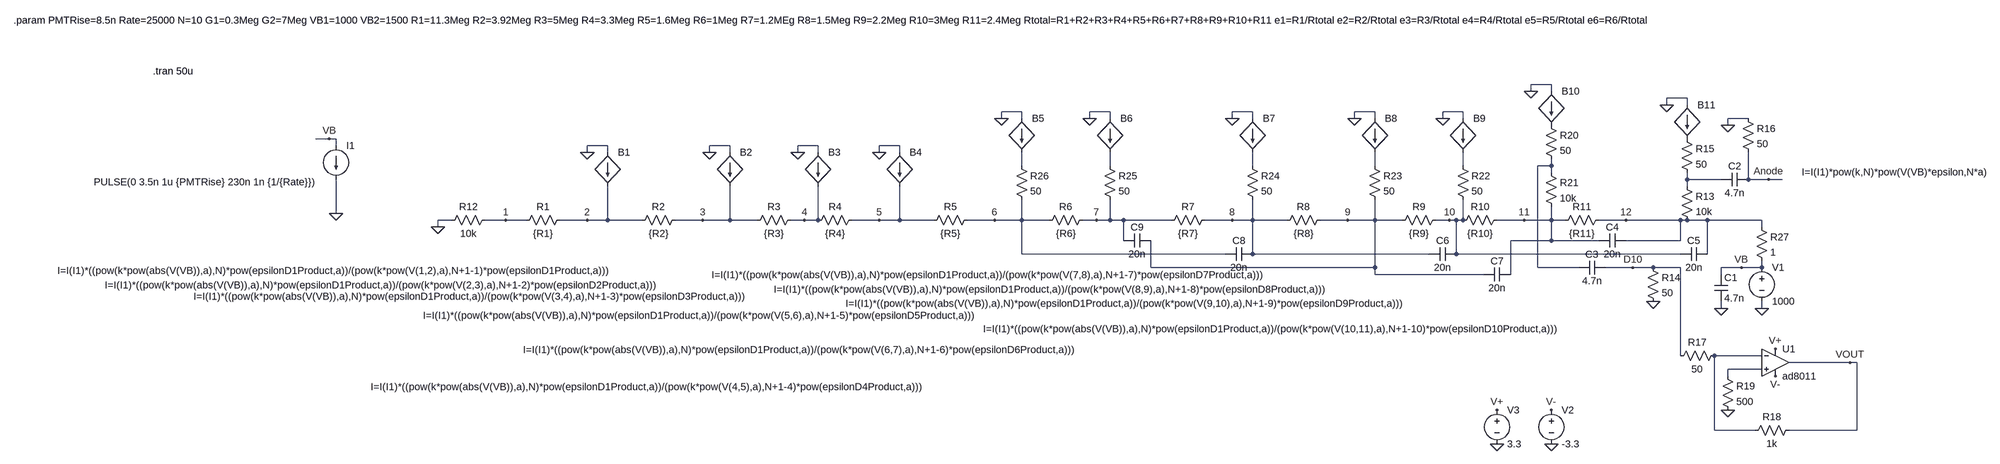
[diagram p0: schematic PMT Model_draft1.asc]
PMT Model_draft1.asc, the LTspice schematic file:
Version 4
SHEET 1 10492 724
WIRE 2576 -144 2528 -144
WIRE 2528 -128 2528 -144
WIRE 2576 -128 2576 -144
WIRE 2896 -112 2848 -112
WIRE 2848 -96 2848 -112
WIRE 2896 -96 2896 -112
WIRE 1328 -80 1280 -80
WIRE 1536 -80 1488 -80
WIRE 1872 -80 1824 -80
WIRE 2160 -80 2112 -80
WIRE 2368 -80 2320 -80
WIRE 1280 -64 1280 -80
WIRE 1328 -64 1328 -80
WIRE 1488 -64 1488 -80
WIRE 1536 -64 1536 -80
WIRE 1824 -64 1824 -80
WIRE 1872 -64 1872 -80
WIRE 2112 -64 2112 -80
WIRE 2160 -64 2160 -80
WIRE 2320 -64 2320 -80
WIRE 2368 -64 2368 -80
WIRE 3040 -64 2992 -64
WIRE 2992 -48 2992 -64
WIRE -304 -16 -336 -16
WIRE -288 -16 -304 -16
WIRE -288 0 -288 -16
WIRE 352 0 304 0
WIRE 640 0 592 0
WIRE 848 0 800 0
WIRE 1040 0 992 0
WIRE 304 16 304 0
WIRE 352 16 352 0
WIRE 592 16 592 0
WIRE 640 16 640 0
WIRE 800 16 800 0
WIRE 848 16 848 0
WIRE 992 16 992 0
WIRE 1040 16 1040 0
WIRE 1328 48 1328 16
WIRE 1536 48 1536 16
WIRE 1872 48 1872 16
WIRE 2160 48 2160 16
WIRE 2368 48 2368 16
WIRE 2576 48 2576 32
WIRE 2576 48 2544 48
WIRE 2576 64 2576 48
WIRE 2896 80 2896 64
WIRE 2976 80 2896 80
WIRE 3040 80 3040 16
WIRE 3088 80 3040 80
WIRE 3120 80 3088 80
WIRE 2896 96 2896 80
WIRE -288 160 -288 80
WIRE -16 176 -48 176
WIRE 112 176 64 176
WIRE 160 176 112 176
WIRE 304 176 240 176
WIRE 352 176 352 96
WIRE 352 176 304 176
WIRE 432 176 352 176
WIRE 576 176 512 176
WIRE 640 176 640 96
WIRE 640 176 576 176
WIRE 704 176 640 176
WIRE 816 176 784 176
WIRE 848 176 848 96
WIRE 848 176 816 176
WIRE 992 176 928 176
WIRE 1040 176 1040 96
WIRE 1040 176 992 176
WIRE 1120 176 1040 176
WIRE 1264 176 1200 176
WIRE 1328 176 1328 128
WIRE 1328 176 1264 176
WIRE 1392 176 1328 176
WIRE 1504 176 1472 176
WIRE 1536 176 1536 128
WIRE 1536 176 1504 176
WIRE 1568 176 1536 176
WIRE 1680 176 1568 176
WIRE 1824 176 1760 176
WIRE 1872 176 1872 128
WIRE 1872 176 1824 176
WIRE 1952 176 1872 176
WIRE 2096 176 2032 176
WIRE 2160 176 2160 128
WIRE 2160 176 2096 176
WIRE 2224 176 2160 176
WIRE 2336 176 2304 176
WIRE 2352 176 2336 176
WIRE 2368 176 2368 128
WIRE 2368 176 2352 176
WIRE 2512 176 2448 176
WIRE 2576 176 2576 144
WIRE 2576 176 2512 176
WIRE 2608 176 2576 176
WIRE 2752 176 2688 176
WIRE 2880 176 2752 176
WIRE 2896 176 2880 176
WIRE 2944 176 2896 176
WIRE 3072 176 2944 176
WIRE -48 192 -48 176
WIRE 3072 192 3072 176
WIRE 1568 224 1568 176
WIRE 2576 224 2576 176
WIRE 2576 224 2480 224
WIRE 2688 224 2576 224
WIRE 2880 224 2880 176
WIRE 2880 224 2752 224
WIRE 1328 256 1328 176
WIRE 1808 256 1328 256
WIRE 1872 256 1872 176
WIRE 2288 256 1872 256
WIRE 2352 256 2352 176
WIRE 2880 256 2352 256
WIRE 2944 256 2944 176
WIRE 1632 288 1632 224
WIRE 2160 288 2160 176
WIRE 2160 288 1632 288
WIRE 2544 288 2544 48
WIRE 2640 288 2544 288
WIRE 2768 288 2704 288
WIRE 2816 288 2768 288
WIRE 2880 288 2816 288
WIRE 3024 288 2976 288
WIRE 3072 288 3072 272
WIRE 3072 288 3024 288
WIRE 2160 304 2160 288
WIRE 2416 304 2160 304
WIRE 2480 304 2480 224
WIRE 2976 304 2976 288
WIRE 2976 384 2976 368
WIRE 3072 384 3072 368
WIRE 2880 496 2880 288
WIRE 3072 496 2960 496
WIRE 3280 512 3136 512
WIRE 3296 512 3280 512
WIRE 3072 528 2992 528
WIRE 2992 544 2992 528
WIRE 2960 672 2960 496
WIRE 3056 672 2960 672
WIRE 3296 672 3296 512
WIRE 3296 672 3136 672
FLAG 3072 384 0
FLAG 2976 384 0
FLAG 304 16 0
FLAG 3024 288 VB
FLAG 112 176 1
FLAG 304 176 2
FLAG 592 16 0
FLAG 576 176 3
FLAG 800 16 0
FLAG 816 176 4
FLAG 992 16 0
FLAG 992 176 5
FLAG 1280 -64 0
FLAG 1264 176 6
FLAG 1488 -64 0
FLAG 1504 176 7
FLAG 1824 -64 0
FLAG 1824 176 8
FLAG 2112 -64 0
FLAG 2096 176 9
FLAG 2320 -64 0
FLAG 2336 176 10
FLAG 2512 176 11
FLAG 2528 -128 0
FLAG 2752 176 12
FLAG 2816 368 0
FLAG 2768 288 D10
FLAG -304 -16 VB
FLAG -288 160 0
FLAG -48 192 0
FLAG 2848 -96 0
FLAG 2992 -48 0
FLAG 3088 80 Anode
FLAG 2448 704 0
FLAG 2576 704 0
FLAG 2576 624 V-
FLAG 3104 544 V-
FLAG 2448 624 V+
FLAG 3104 480 V+
FLAG 2992 624 0
FLAG 3280 512 VOUT
SYMBOL res 256 160 R90
WINDOW 0 0 56 VBottom 2
WINDOW 3 32 56 VTop 2
SYMATTR InstName R1
SYMATTR Value {R1}
SYMBOL current -288 0 R0
WINDOW 3 -571 86 Left 2
WINDOW 123 0 0 Left 0
WINDOW 39 0 0 Left 0
SYMATTR Value PULSE(0 3.5n 1u {PMTRise} 230n 1n {1/{Rate}})
SYMATTR InstName I1
SYMBOL voltage 3072 272 R0
WINDOW 123 0 0 Left 0
WINDOW 39 0 0 Left 0
SYMATTR InstName V1
SYMATTR Value 1000
SYMBOL cap 2960 304 R0
SYMATTR InstName C1
SYMATTR Value 4.7n
SYMBOL bi 352 16 R0
WINDOW 3 -1297 279 Left 2
SYMATTR Value I=I(I1)*((pow(k*pow(abs(V(VB)),a),N)*pow(epsilonD1Product,a))/(pow(k*pow(V(1,2),a),N+1-1)*pow(epsilonD1Product,a)))
SYMATTR InstName B1
SYMBOL bi 640 16 R0
WINDOW 3 -1473 313 Left 2
SYMATTR Value I=I(I1)*((pow(k*pow(abs(V(VB)),a),N)*pow(epsilonD1Product,a))/(pow(k*pow(V(2,3),a),N+1-2)*pow(epsilonD2Product,a)))
SYMATTR InstName B2
SYMBOL res 528 160 R90
WINDOW 0 0 56 VBottom 2
WINDOW 3 32 56 VTop 2
SYMATTR InstName R2
SYMATTR Value {R2}
SYMBOL bi 848 16 R0
WINDOW 3 -1472 340 Left 2
SYMATTR Value I=I(I1)*((pow(k*pow(abs(V(VB)),a),N)*pow(epsilonD1Product,a))/(pow(k*pow(V(3,4),a),N+1-3)*pow(epsilonD3Product,a)))
SYMATTR InstName B3
SYMBOL res 800 160 R90
WINDOW 0 0 56 VBottom 2
WINDOW 3 32 56 VTop 2
SYMATTR InstName R3
SYMATTR Value {R3}
SYMBOL res 944 160 R90
WINDOW 0 0 56 VBottom 2
WINDOW 3 32 56 VTop 2
SYMATTR InstName R4
SYMATTR Value {R4}
SYMBOL bi 1040 16 R0
WINDOW 3 -1246 553 Left 2
SYMATTR Value I=I(I1)*((pow(k*pow(abs(V(VB)),a),N)*pow(epsilonD1Product,a))/(pow(k*pow(V(4,5),a),N+1-4)*pow(epsilonD4Product,a)))
SYMATTR InstName B4
SYMBOL bi 1328 -64 R0
WINDOW 3 -1411 465 Left 2
SYMATTR Value I=I(I1)*((pow(k*pow(abs(V(VB)),a),N)*pow(epsilonD1Product,a))/(pow(k*pow(V(5,6),a),N+1-5)*pow(epsilonD5Product,a)))
SYMATTR InstName B5
SYMBOL res 1216 160 R90
WINDOW 0 0 56 VBottom 2
WINDOW 3 32 56 VTop 2
SYMATTR InstName R5
SYMATTR Value {R5}
SYMBOL bi 1536 -64 R0
WINDOW 3 -1383 546 Left 2
SYMATTR Value I=I(I1)*((pow(k*pow(abs(V(VB)),a),N)*pow(epsilonD1Product,a))/(pow(k*pow(V(6,7),a),N+1-6)*pow(epsilonD6Product,a)))
SYMATTR InstName B6
SYMBOL res 1488 160 R90
WINDOW 0 0 56 VBottom 2
WINDOW 3 32 56 VTop 2
SYMATTR InstName R6
SYMATTR Value {R6}
SYMBOL res 1776 160 R90
WINDOW 0 0 56 VBottom 2
WINDOW 3 32 56 VTop 2
SYMATTR InstName R7
SYMATTR Value {R7}
SYMBOL bi 1872 -64 R0
WINDOW 3 -1275 369 Left 2
SYMATTR Value I=I(I1)*((pow(k*pow(abs(V(VB)),a),N)*pow(epsilonD1Product,a))/(pow(k*pow(V(7,8),a),N+1-7)*pow(epsilonD7Product,a)))
SYMATTR InstName B7
SYMBOL bi 2160 -64 R0
WINDOW 3 -1416 403 Left 2
SYMATTR Value I=I(I1)*((pow(k*pow(abs(V(VB)),a),N)*pow(epsilonD1Product,a))/(pow(k*pow(V(8,9),a),N+1-8)*pow(epsilonD8Product,a)))
SYMATTR InstName B8
SYMBOL res 2048 160 R90
WINDOW 0 0 56 VBottom 2
WINDOW 3 32 56 VTop 2
SYMATTR InstName R8
SYMATTR Value {R8}
SYMBOL bi 2368 -64 R0
WINDOW 3 -1455 437 Left 2
SYMATTR Value I=I(I1)*((pow(k*pow(abs(V(VB)),a),N)*pow(epsilonD1Product,a))/(pow(k*pow(V(9,10),a),N+1-9)*pow(epsilonD9Product,a)))
SYMATTR InstName B9
SYMBOL res 2320 160 R90
WINDOW 0 0 56 VBottom 2
WINDOW 3 32 56 VTop 2
SYMATTR InstName R9
SYMATTR Value {R9}
SYMBOL res 2464 160 R90
WINDOW 0 0 56 VBottom 2
WINDOW 3 32 56 VTop 2
SYMATTR InstName R10
SYMATTR Value {R10}
SYMBOL bi 2576 -128 R0
WINDOW 3 -1339 561 Left 2
SYMATTR Value I=I(I1)*((pow(k*pow(abs(V(VB)),a),N)*pow(epsilonD1Product,a))/(pow(k*pow(V(10,11),a),N+1-10)*pow(epsilonD10Product,a)))
SYMATTR InstName B10
SYMBOL res 2704 160 R90
WINDOW 0 0 56 VBottom 2
WINDOW 3 32 56 VTop 2
SYMATTR InstName R11
SYMATTR Value {R11}
SYMBOL cap 2704 272 R90
WINDOW 0 0 32 VBottom 2
WINDOW 3 32 32 VTop 2
SYMATTR InstName C3
SYMATTR Value 4.7n
SYMBOL res 2800 272 R0
SYMATTR InstName R14
SYMATTR Value 50
SYMBOL res 80 160 R90
WINDOW 0 0 56 VBottom 2
WINDOW 3 32 56 VTop 2
SYMATTR InstName R12
SYMATTR Value 10k
SYMBOL bi 2896 -96 R0
WINDOW 3 270 159 Left 2
SYMATTR Value I=I(I1)*pow(k,N)*pow(V(VB)*epsilon,N*a)
SYMATTR InstName B11
SYMBOL res 2880 80 R0
SYMATTR InstName R13
SYMATTR Value 10k
SYMBOL res 2880 -32 R0
SYMATTR InstName R15
SYMATTR Value 50
SYMBOL cap 3040 64 R90
WINDOW 0 0 32 VBottom 2
WINDOW 3 32 32 VTop 2
SYMATTR InstName C2
SYMATTR Value 4.7n
SYMBOL res 3024 -80 R0
SYMATTR InstName R16
SYMATTR Value 50
SYMBOL OpAmps\\ad8011 3104 448 R0
SYMATTR InstName U1
SYMBOL res 2976 480 R90
WINDOW 0 0 56 VBottom 2
WINDOW 3 32 56 VTop 2
SYMATTR InstName R17
SYMATTR Value 50
SYMBOL res 3152 656 R90
WINDOW 0 0 56 VBottom 2
WINDOW 3 32 56 VTop 2
SYMATTR InstName R18
SYMATTR Value 1k
SYMBOL voltage 2576 608 R0
WINDOW 123 0 0 Left 0
WINDOW 39 0 0 Left 0
SYMATTR InstName V2
SYMATTR Value -3.3
SYMBOL voltage 2448 608 R0
WINDOW 123 0 0 Left 0
WINDOW 39 0 0 Left 0
SYMATTR InstName V3
SYMATTR Value 3.3
SYMBOL res 2976 528 R0
SYMATTR InstName R19
SYMATTR Value 500
SYMBOL res 2560 -64 R0
SYMATTR InstName R20
SYMATTR Value 50
SYMBOL res 2560 48 R0
SYMATTR InstName R21
SYMATTR Value 10k
SYMBOL cap 2752 208 R90
WINDOW 0 0 32 VBottom 2
WINDOW 3 32 32 VTop 2
SYMATTR InstName C4
SYMATTR Value 20n
SYMBOL cap 2944 240 R90
WINDOW 0 0 32 VBottom 2
WINDOW 3 32 32 VTop 2
SYMATTR InstName C5
SYMATTR Value 20n
SYMBOL cap 2352 240 R90
WINDOW 0 0 32 VBottom 2
WINDOW 3 32 32 VTop 2
SYMATTR InstName C6
SYMATTR Value 20n
SYMBOL cap 2480 288 R90
WINDOW 0 0 32 VBottom 2
WINDOW 3 32 32 VTop 2
SYMATTR InstName C7
SYMATTR Value 20n
SYMBOL cap 1872 240 R90
WINDOW 0 0 32 VBottom 2
WINDOW 3 32 32 VTop 2
SYMATTR InstName C8
SYMATTR Value 20n
SYMBOL cap 1632 208 R90
WINDOW 0 0 32 VBottom 2
WINDOW 3 32 32 VTop 2
SYMATTR InstName C9
SYMATTR Value 20n
SYMBOL res 2352 32 R0
SYMATTR InstName R22
SYMATTR Value 50
SYMBOL res 2144 32 R0
SYMATTR InstName R23
SYMATTR Value 50
SYMBOL res 1856 32 R0
SYMATTR InstName R24
SYMATTR Value 50
SYMBOL res 1520 32 R0
SYMATTR InstName R25
SYMATTR Value 50
SYMBOL res 1312 32 R0
SYMATTR InstName R26
SYMATTR Value 50
SYMBOL res 3056 176 R0
SYMATTR InstName R27
SYMATTR Value 1
TEXT -720 -176 Left 2 !.tran 50u
TEXT -1048 -296 Left 2 !.param PMTRise=8.5n Rate=25000 N=10 G1=0.3Meg G2=7Meg VB1=1000 VB2=1500 R1=11.3Meg R2=3.92Meg R3=5Meg R4=3.3Meg R5=1.6Meg R6=1Meg R7=1.2MEg R8=1.5Meg R9=2.2Meg R10=3Meg R11=2.4Meg Rtotal=R1+R2+R3+R4+R5+R6+R7+R8+R9+R10+R11 e1=R1/Rtotal e2=R2/Rtotal e3=R3/Rtotal e4=R4/Rtotal e5=R5/Rtotal e6=R6/Rtotal e7=R7/Rtotal e8=R8/Rtotal e9=R9/Rtotal e10=R10/Rtotal e11=R11/Rtotal epsilonD1Product=e1*e2*e3*e4*e5*e6*e7*e8*e9*e10 epsilonD2Product=e1*e2*e3*e4*e5*e6*e7*e8*e9 epsilonD3Product=e1*e2*e3*e4*e5*e6*e7*e8 epsilonD4Product=e1*e2*e3*e4*e5*e6*e7 epsilonD5Product=e1*e2*e3*e4*e5*e6 epsilonD6Product=e1*e2*e3*e4*e5 epsilonD7Product=e1*e2*e3*e4 epsilonD8Product=e1*e2*e3 epsilonD9Product=e1*e2 epsilonD10Product=e1 epsilon=pow(10,(1/N)*log10(e1*e2*e3*e4*e5*e6*e7*e8*e9*e10*e11)) a=log(G1/G2)/(N*log(VB1/VB2)) k=pow(10,(1/N)*log10(G2/pow(VB2*epsilon,N*a)))

The netlist it stands for:
* PMT Model_draft1.asc
R1 2 1 {R1}
I1 VB 0 PULSE(0 3.5n 1u {PMTRise} 230n 1n {1/{Rate}})
V1 VB 0 1000
C1 VB 0 4.7n
B1 0 2 I=I(I1)*((pow(k*pow(abs(V(VB)),a),N)*pow(epsilonD1Product,a))/(pow(k*pow(V(1,2),a),N+1-1)*pow(epsilonD1Product,a)))
B2 0 3 I=I(I1)*((pow(k*pow(abs(V(VB)),a),N)*pow(epsilonD1Product,a))/(pow(k*pow(V(2,3),a),N+1-2)*pow(epsilonD2Product,a)))
R2 3 2 {R2}
B3 0 4 I=I(I1)*((pow(k*pow(abs(V(VB)),a),N)*pow(epsilonD1Product,a))/(pow(k*pow(V(3,4),a),N+1-3)*pow(epsilonD3Product,a)))
R3 4 3 {R3}
R4 5 4 {R4}
B4 0 5 I=I(I1)*((pow(k*pow(abs(V(VB)),a),N)*pow(epsilonD1Product,a))/(pow(k*pow(V(4,5),a),N+1-4)*pow(epsilonD4Product,a)))
B5 0 N001 I=I(I1)*((pow(k*pow(abs(V(VB)),a),N)*pow(epsilonD1Product,a))/(pow(k*pow(V(5,6),a),N+1-5)*pow(epsilonD5Product,a)))
R5 6 5 {R5}
B6 0 N002 I=I(I1)*((pow(k*pow(abs(V(VB)),a),N)*pow(epsilonD1Product,a))/(pow(k*pow(V(6,7),a),N+1-6)*pow(epsilonD6Product,a)))
R6 7 6 {R6}
R7 8 7 {R7}
B7 0 N003 I=I(I1)*((pow(k*pow(abs(V(VB)),a),N)*pow(epsilonD1Product,a))/(pow(k*pow(V(7,8),a),N+1-7)*pow(epsilonD7Product,a)))
B8 0 N004 I=I(I1)*((pow(k*pow(abs(V(VB)),a),N)*pow(epsilonD1Product,a))/(pow(k*pow(V(8,9),a),N+1-8)*pow(epsilonD8Product,a)))
R8 9 8 {R8}
B9 0 N005 I=I(I1)*((pow(k*pow(abs(V(VB)),a),N)*pow(epsilonD1Product,a))/(pow(k*pow(V(9,10),a),N+1-9)*pow(epsilonD9Product,a)))
R9 10 9 {R9}
R10 11 10 {R10}
B10 0 P001 I=I(I1)*((pow(k*pow(abs(V(VB)),a),N)*pow(epsilonD1Product,a))/(pow(k*pow(V(10,11),a),N+1-10)*pow(epsilonD10Product,a)))
R11 12 11 {R11}
C3 D10 N006 4.7n
R14 D10 0 50
R12 1 0 10k
B11 0 P002 I=I(I1)*pow(k,N)*pow(V(VB)*epsilon,N*a)
R13 N007 12 10k
R15 P002 N007 50
C2 Anode N007 4.7n
R16 0 Anode 50
XU1 N009 N008 V+ V- VOUT ad8011  ; pins In+ In- V+ V- OUT
R17 N008 D10 50
R18 VOUT N008 1k
V2 V- 0 -3.3
V3 V+ 0 3.3
R19 N009 0 500
R20 P001 N006 50
R21 N006 11 10k
C4 12 11 20n
C5 12 10 20n
C6 10 8 20n
C7 11 9 20n
C8 8 6 20n
C9 9 7 20n
R22 N005 10 50
R23 N004 9 50
R24 N003 8 50
R25 N002 7 50
R26 N001 6 50
R27 12 VB 1
.tran 50u
.param PMTRise=8.5n Rate=25000 N=10 G1=0.3Meg G2=7Meg VB1=1000 VB2=1500 R1=11.3Meg R2=3.92Meg R3=5Meg R4=3.3Meg R5=1.6Meg R6=1Meg R7=1.2MEg R8=1.5Meg R9=2.2Meg R10=3Meg R11=2.4Meg Rtotal=R1+R2+R3+R4+R5+R6+R7+R8+R9+R10+R11 e1=R1/Rtotal e2=R2/Rtotal e3=R3/Rtotal e4=R4/Rtotal e5=R5/Rtotal e6=R6/Rtotal e7=R7/Rtotal e8=R8/Rtotal e9=R9/Rtotal e10=R10/Rtotal e11=R11/Rtotal epsilonD1Product=e1*e2*e3*e4*e5*e6*e7*e8*e9*e10 epsilonD2Product=e1*e2*e3*e4*e5*e6*e7*e8*e9 epsilonD3Product=e1*e2*e3*e4*e5*e6*e7*e8 epsilonD4Product=e1*e2*e3*e4*e5*e6*e7 epsilonD5Product=e1*e2*e3*e4*e5*e6 epsilonD6Product=e1*e2*e3*e4*e5 epsilonD7Product=e1*e2*e3*e4 epsilonD8Product=e1*e2*e3 epsilonD9Product=e1*e2 epsilonD10Product=e1 epsilon=pow(10,(1/N)*log10(e1*e2*e3*e4*e5*e6*e7*e8*e9*e10*e11)) a=log(G1/G2)/(N*log(VB1/VB2)) k=pow(10,(1/N)*log10(G2/pow(VB2*epsilon,N*a)))
.backanno
.end